# Altium schematic sheet UnidadDeControl-STM.SchDoc
size A4; SheetNumber: 9; SheetTotal: 10
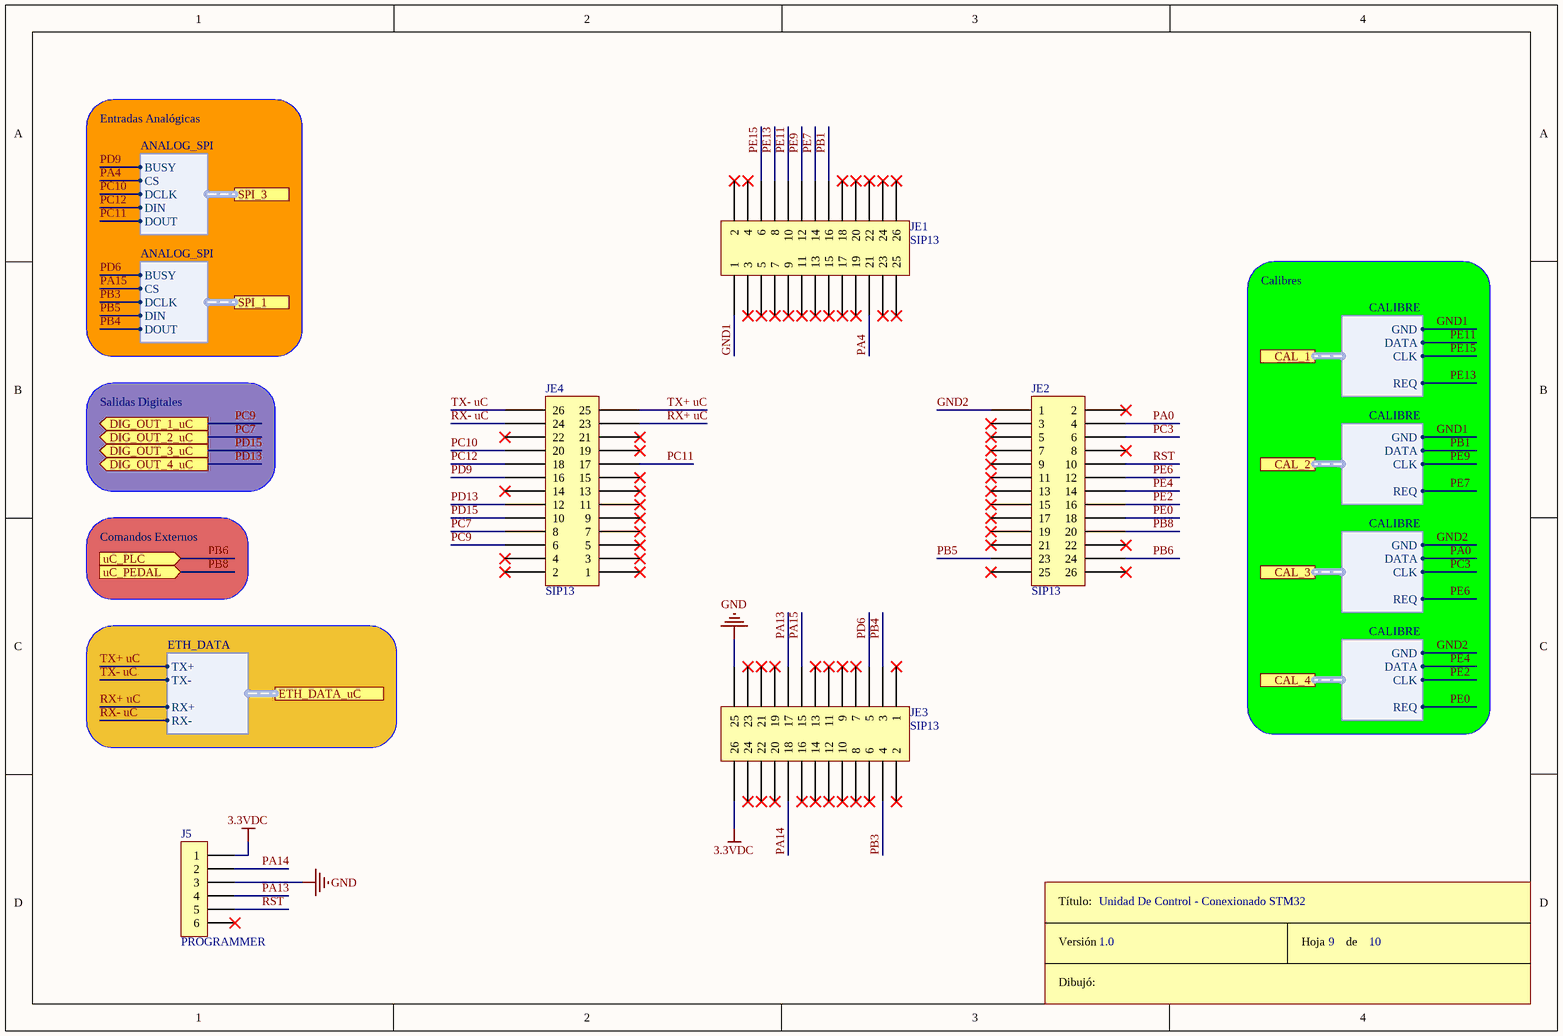
[diagram p0: UnidadDeControl-STM.SchDoc]

## Parts
J5  PROGRAMMER  [SIP6]
JE1  SIP13  [SIP13*2 - HDR]
JE2  SIP13  [SIP13*2 - HDR]
JE3  SIP13  [SIP13*2 - HDR]
JE4  SIP13  [SIP13*2 - HDR]
ROT8  Rótulo  (value not drawn)  (graphical)

## Ports
CAL_1 (harness CALIBRE), CAL_2 (harness CALIBRE), CAL_3 (harness CALIBRE), CAL_4 (harness CALIBRE), DIG_OUT_1_uC (out), DIG_OUT_2_uC (out), DIG_OUT_3_uC (out), DIG_OUT_4_uC (out), ETH_DATA_uC (harness ETH_DATA), SPI_1 (harness ANALOG_SPI), SPI_3 (harness ANALOG_SPI), uC_PEDAL (in), uC_PLC (in)

## Harnesses
ANALOG_SPI: BUSY, CS, DCLK, DIN, DOUT
CALIBRE: CLK, DATA, GND, REQ
ETH_DATA: RX+, RX-, TX+, TX-

## Nets
3.3VDC: J5.1 JE3.26
GND: J5.3 JE3.25
GND1: JE1.1 ; port CAL_1.GND, port CAL_2.GND
GND2: JE2.1 ; port CAL_3.GND, port CAL_4.GND
PA0: JE2.4 ; port CAL_3.DATA
PA4: JE1.21 ; port SPI_3.CS
PA13: J5.4 JE3.17
PA14: J5.2 JE3.18
PA15: JE3.15 ; port SPI_1.CS
PB1: JE1.16 ; port CAL_2.DATA
PB3: JE3.4 ; port SPI_1.DCLK
PB4: JE3.3 ; port SPI_1.DOUT
PB5: JE2.23 ; port SPI_1.DIN
PB6: JE2.24 ; port uC_PLC
PB8: JE2.20 ; port uC_PEDAL
PC3: JE2.6 ; port CAL_3.CLK
PC7: JE4.8 ; port DIG_OUT_2_uC
PC9: JE4.6 ; port DIG_OUT_1_uC
PC10: JE4.20 ; port SPI_3.DCLK
PC11: JE4.17 ; port SPI_3.DOUT
PC12: JE4.18 ; port SPI_3.DIN
PD6: JE3.5 ; port SPI_1.BUSY
PD9: JE4.16 ; port SPI_3.BUSY
PD13: JE4.12 ; port DIG_OUT_4_uC
PD15: JE4.10 ; port DIG_OUT_3_uC
PE0: JE2.18 ; port CAL_4.REQ
PE2: JE2.16 ; port CAL_4.CLK
PE4: JE2.14 ; port CAL_4.DATA
PE6: JE2.12 ; port CAL_3.REQ
PE7: JE1.14 ; port CAL_2.REQ
PE9: JE1.12 ; port CAL_2.CLK
PE11: JE1.10 ; port CAL_1.DATA
PE13: JE1.8 ; port CAL_1.REQ
PE15: JE1.6 ; port CAL_1.CLK
RST: J5.5 JE2.10
RX+ uC: JE4.23 ; port ETH_DATA_uC.RX+
RX- uC: JE4.24 ; port ETH_DATA_uC.RX-
TX+ uC: JE4.25 ; port ETH_DATA_uC.TX+
TX- uC: JE4.26 ; port ETH_DATA_uC.TX-

Not connected (* = marked no-connect by the designer): J5 6*; JE1 2* 3* 4* 5* 7* 9* 11* 13* 15* 17* 18* 19* 20* 22* 23* 24* 25* 26*; JE2 2* 3* 5* 7* 8* 9* 11* 13* 15* 17* 19* 21* 22* 25* 26*; JE3 1* 2* 6* 7* 8* 9* 10* 11* 12* 13* 14* 16* 19* 20* 21* 22* 23* 24*; JE4 1* 2* 3* 4* 5* 7* 9* 11* 13* 14* 15* 19* 21* 22*

## Notes on the sheet
- Entradas Analógicas
- Calibres
- Salidas Digitales
- Comandos Externos
- Unidad De Control - Conexionado STM32
- 1.0
- 9
- 10
- (in symbol Rótulo) Título:; Versión; Hoja       de; Dibujó:

## Library data of the parts
J5 = CON6
JE1-JE4 = CON13*2